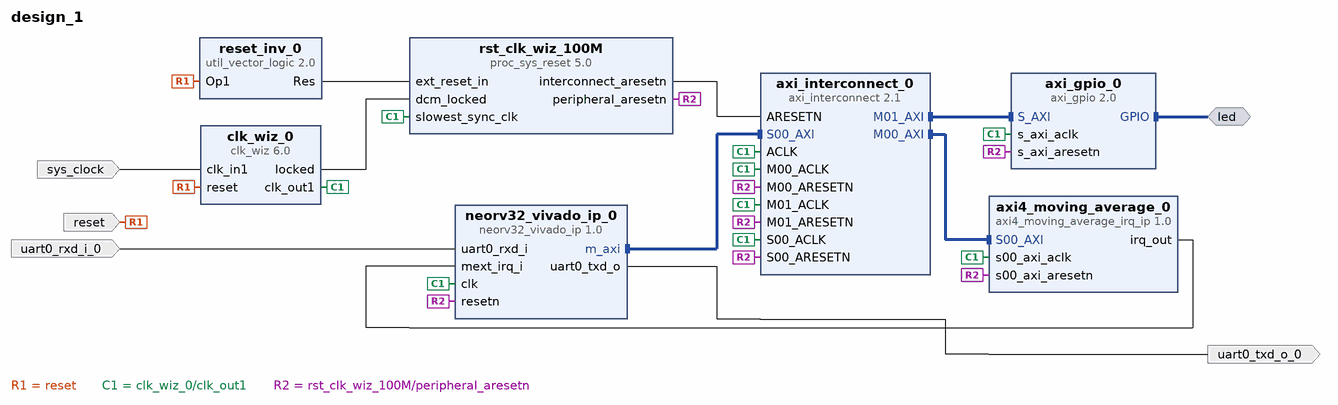
[diagram p0: block diagram of the top level]
# Vivado block design design_1, xc7a100tcsg324-1, Vivado 2019.2
create_bd_design design_1

create_bd_intf_port -mode Master -vlnv xilinx.com:interface:gpio_rtl:1.0 led
create_bd_port -dir I -type clk sys_clock
set_property -dict {CONFIG.FREQ_HZ 100000000 CONFIG.PHASE 0.000} [get_bd_ports sys_clock]
create_bd_port -dir I -type rst reset
set_property -dict {CONFIG.POLARITY ACTIVE_HIGH} [get_bd_ports reset]
create_bd_port -dir O uart0_txd_o_0
create_bd_port -dir I uart0_rxd_i_0

create_bd_cell -type ip -vlnv xilinx.com:user:axi4_moving_average_irq_ip:1.0 axi4_moving_average_0
create_bd_cell -type ip -vlnv xilinx.com:ip:axi_gpio:2.0 axi_gpio_0
set_property -dict {CONFIG.GPIO_BOARD_INTERFACE led_16bits CONFIG.USE_BOARD_FLOW true} [get_bd_cells axi_gpio_0]
create_bd_cell -type ip -vlnv xilinx.com:ip:axi_interconnect:2.1 axi_interconnect_0
set_property -dict {CONFIG.NUM_MI 2} [get_bd_cells axi_interconnect_0]
create_bd_cell -type ip -vlnv xilinx.com:ip:clk_wiz:6.0 clk_wiz_0
set_property -dict {CONFIG.CLK_IN1_BOARD_INTERFACE sys_clock CONFIG.RESET_BOARD_INTERFACE reset} [get_bd_cells clk_wiz_0]
create_bd_cell -type ip -vlnv NEORV32:user:neorv32_vivado_ip:1.0 neorv32_vivado_ip_0
set_property -dict [list \
  CONFIG.BOOT_MODE_SELECT 0 \
  CONFIG.CACHE_BURSTS_EN false \
  CONFIG.CPU_FAST_MUL_EN false \
  CONFIG.CPU_FAST_SHIFT_EN false \
  CONFIG.DMEM_EN true \
  CONFIG.IMEM_EN true \
  CONFIG.IO_GPIO_EN false \
  CONFIG.IO_UART0_EN true \
  CONFIG.RISCV_ISA_C false \
  CONFIG.RISCV_ISA_M true \
  CONFIG.XBUS_EN true \
  CONFIG.XBUS_REGSTAGE_EN false \
] [get_bd_cells neorv32_vivado_ip_0]
create_bd_cell -type ip -vlnv xilinx.com:ip:proc_sys_reset:5.0 rst_clk_wiz_100M
set_property -dict {CONFIG.RESET_BOARD_INTERFACE Custom CONFIG.USE_BOARD_FLOW true} [get_bd_cells rst_clk_wiz_100M]
create_bd_cell -type ip -vlnv xilinx.com:ip:util_vector_logic:2.0 reset_inv_0
set_property -dict {CONFIG.C_OPERATION not CONFIG.C_SIZE 1} [get_bd_cells reset_inv_0]

# ---- connections ----

connect_bd_intf_net [get_bd_intf_pins axi_interconnect_0/M00_AXI] [get_bd_intf_pins axi4_moving_average_0/S00_AXI]
connect_bd_intf_net [get_bd_intf_pins neorv32_vivado_ip_0/m_axi] [get_bd_intf_pins axi_interconnect_0/S00_AXI]
connect_bd_intf_net [get_bd_intf_ports led] [get_bd_intf_pins axi_gpio_0/GPIO]
connect_bd_intf_net [get_bd_intf_pins axi_interconnect_0/M01_AXI] [get_bd_intf_pins axi_gpio_0/S_AXI]
connect_bd_net [get_bd_pins neorv32_vivado_ip_0/uart0_txd_o] [get_bd_ports uart0_txd_o_0]
connect_bd_net -net uart0_rxd_i_0_1 [get_bd_ports uart0_rxd_i_0] [get_bd_pins neorv32_vivado_ip_0/uart0_rxd_i]
connect_bd_net -net util_vector_logic_0_Res [get_bd_pins reset_inv_0/Res] [get_bd_pins rst_clk_wiz_100M/ext_reset_in]
connect_bd_net [get_bd_ports sys_clock] [get_bd_pins clk_wiz_0/clk_in1]
connect_bd_net [get_bd_ports reset] [get_bd_pins clk_wiz_0/reset] [get_bd_pins reset_inv_0/Op1]
connect_bd_net [get_bd_pins clk_wiz_0/clk_out1] \
  [get_bd_pins axi4_moving_average_0/s00_axi_aclk] [get_bd_pins axi_gpio_0/s_axi_aclk] [get_bd_pins axi_interconnect_0/ACLK] \
  [get_bd_pins axi_interconnect_0/S00_ACLK] [get_bd_pins axi_interconnect_0/M00_ACLK] \
  [get_bd_pins axi_interconnect_0/M01_ACLK] [get_bd_pins neorv32_vivado_ip_0/clk] \
  [get_bd_pins rst_clk_wiz_100M/slowest_sync_clk]
connect_bd_net [get_bd_pins clk_wiz_0/locked] [get_bd_pins rst_clk_wiz_100M/dcm_locked]
connect_bd_net [get_bd_pins rst_clk_wiz_100M/interconnect_aresetn] [get_bd_pins axi_interconnect_0/ARESETN]
connect_bd_net [get_bd_pins rst_clk_wiz_100M/peripheral_aresetn] \
  [get_bd_pins axi4_moving_average_0/s00_axi_aresetn] [get_bd_pins axi_gpio_0/s_axi_aresetn] \
  [get_bd_pins axi_interconnect_0/S00_ARESETN] [get_bd_pins axi_interconnect_0/M00_ARESETN] \
  [get_bd_pins axi_interconnect_0/M01_ARESETN] [get_bd_pins neorv32_vivado_ip_0/resetn]
connect_bd_net [get_bd_pins axi4_moving_average_0/irq_out] [get_bd_pins neorv32_vivado_ip_0/mext_irq_i]

# ---- address map ----
assign_bd_address -offset 0x40000000 -range 64K -target_address_space [get_bd_addr_spaces neorv32_vivado_ip_0/m_axi] [get_bd_addr_segs axi_gpio_0/S_AXI/Reg]
assign_bd_address -offset 0x44A00000 -range 64K -target_address_space [get_bd_addr_spaces neorv32_vivado_ip_0/m_axi] [get_bd_addr_segs axi4_moving_average_0/S00_AXI/S00_AXI_reg]

validate_bd_design
save_bd_design
